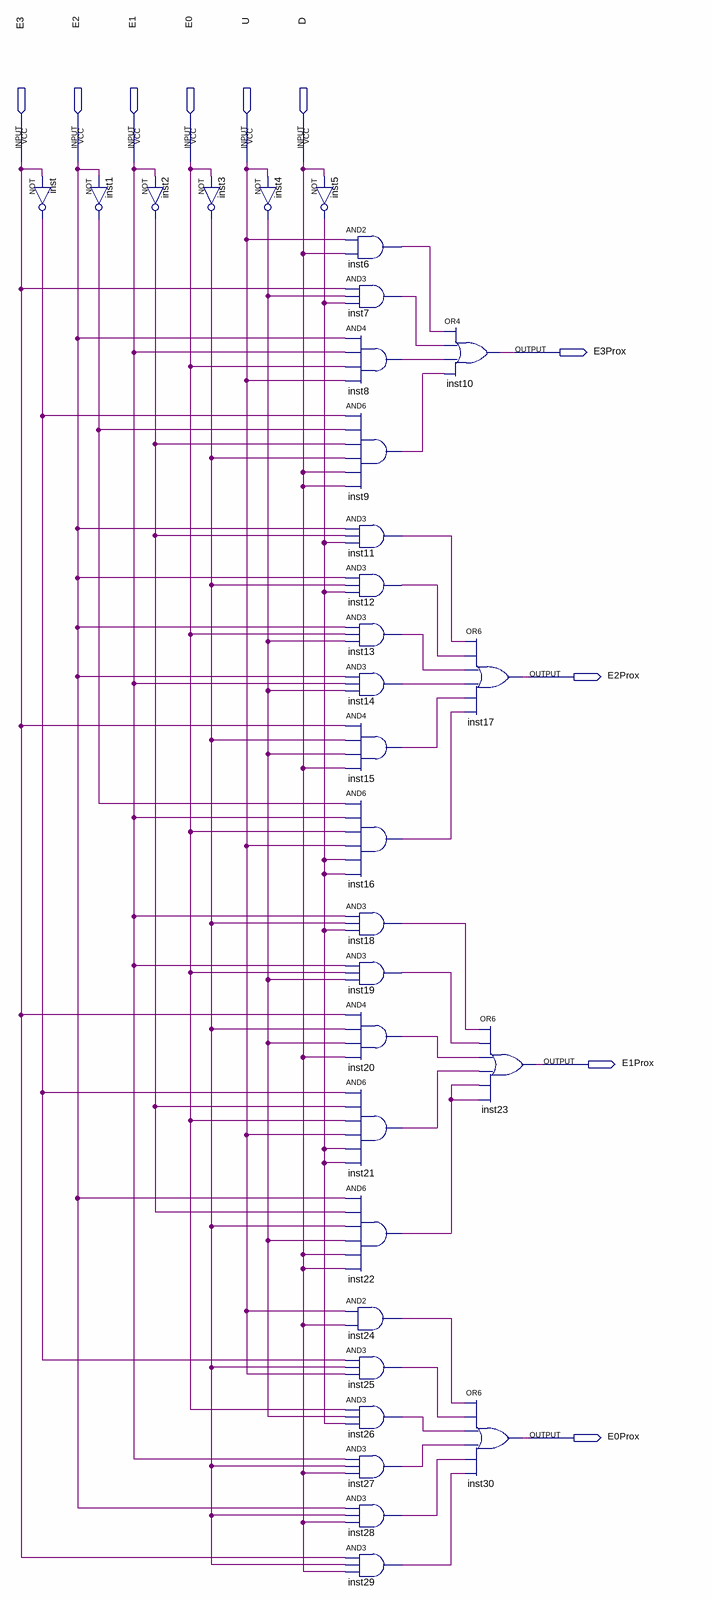
[diagram p0: schematic sheet]
// Quartus schematic ProxEstado.bdf as structural Verilog: 31 symbols, 10 pins
module ProxEstado (
  input  E3,
  input  E2,
  input  E1,
  input  E0,
  input  U,
  input  D,
  output E3Prox,
  output E2Prox,
  output E1Prox,
  output E0Prox
);

  wire inst1_out, inst2_out, inst3_out, inst4_out, inst5_out, inst6_out, inst7_out, inst8_out, inst9_out,
       inst11_out, inst12_out, inst13_out, inst14_out, inst15_out, inst16_out, inst18_out, inst19_out,
       inst20_out, inst21_out, inst22_out, inst24_out, inst25_out, inst26_out, inst27_out, inst28_out,
       inst29_out, inst_out;

  not inst (inst_out, E3);
  not inst1 (inst1_out, E2);
  not inst2 (inst2_out, E1);
  not inst3 (inst3_out, E0);
  not inst4 (inst4_out, U);
  not inst5 (inst5_out, D);
  and inst6 (inst6_out, U, D);
  and inst7 (inst7_out, E3, inst4_out, inst5_out);
  and inst8 (inst8_out, E2, E1, E0, U);
  and inst9 (inst9_out, inst_out, inst1_out, inst2_out, inst3_out, D, D);
  and inst11 (inst11_out, E2, inst2_out, inst5_out);
  and inst12 (inst12_out, E2, inst3_out, inst5_out);
  and inst13 (inst13_out, E2, E0, inst4_out);
  and inst14 (inst14_out, E2, E1, inst4_out);
  and inst15 (inst15_out, E3, inst3_out, inst4_out, D);
  and inst16 (inst16_out, inst1_out, E1, E0, U, inst5_out, inst5_out);
  and inst18 (inst18_out, E1, inst3_out, inst5_out);
  and inst19 (inst19_out, E1, E0, inst4_out);
  and inst20 (inst20_out, E3, inst3_out, inst4_out, D);
  and inst21 (inst21_out, inst_out, inst2_out, E0, U, inst5_out, inst5_out);
  and inst22 (inst22_out, E2, inst2_out, inst3_out, inst4_out, D, D);
  and inst24 (inst24_out, U, D);
  and inst25 (inst25_out, inst_out, inst3_out, U);
  and inst26 (inst26_out, E0, inst4_out, inst5_out);
  and inst27 (inst27_out, E1, inst3_out, D);
  and inst28 (inst28_out, E2, inst3_out, D);
  and inst29 (inst29_out, E3, inst3_out, D);
  or inst10 (E3Prox, inst6_out, inst7_out, inst8_out, inst9_out);
  or inst17 (E2Prox, inst11_out, inst12_out, inst13_out, inst14_out, inst15_out, inst16_out);
  or inst30 (E0Prox, inst24_out, inst25_out, inst26_out, inst27_out, inst28_out, inst29_out);
  or inst23 (E1Prox, inst18_out, inst19_out, inst20_out, inst21_out, inst22_out, inst22_out);
endmodule
